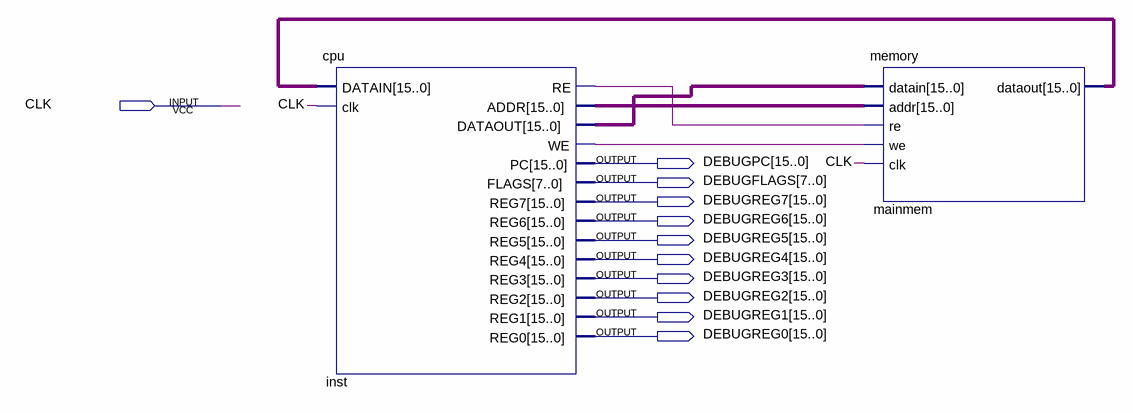
[diagram p0: schematic sheet]
// Quartus schematic SixteenBitCPUBlock.bdf as structural Verilog: 2 symbols, 11 pins
module SixteenBitCPUBlock (
  input  CLK,
  output [15:0] DEBUGPC,
  output [7:0] DEBUGFLAGS,
  output [15:0] DEBUGREG7,
  output [15:0] DEBUGREG6,
  output [15:0] DEBUGREG5,
  output [15:0] DEBUGREG4,
  output [15:0] DEBUGREG3,
  output [15:0] DEBUGREG2,
  output [15:0] DEBUGREG1,
  output [15:0] DEBUGREG0
);

  wire inst_re, inst_we;
  wire [15:0] inst_addr, inst_dataout, mainmem_dataout;

  cpu inst (
    .DATAIN(mainmem_dataout), .clk(CLK), .RE(inst_re), .ADDR(inst_addr), .DATAOUT(inst_dataout),
    .WE(inst_we), .PC(DEBUGPC), .FLAGS(DEBUGFLAGS), .REG7(DEBUGREG7), .REG6(DEBUGREG6), .REG5(DEBUGREG5),
    .REG4(DEBUGREG4), .REG3(DEBUGREG3), .REG2(DEBUGREG2), .REG1(DEBUGREG1), .REG0(DEBUGREG0));
  memory mainmem (
    .datain(inst_dataout), .addr(inst_addr), .re(inst_re), .we(inst_we), .clk(CLK), .dataout(mainmem_dataout));
endmodule
